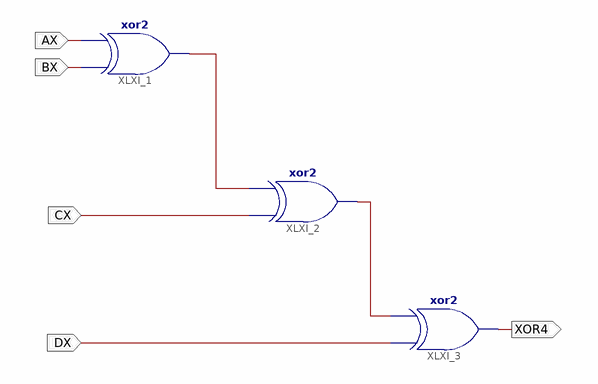
[diagram p0: schematic sheet 1]
// Xilinx ISE schematic XOR_4.sch (spartan6) as structural Verilog: 3 symbols, 5 ports
module XOR_4 (
  input  CX,
  input  DX,
  input  AX,
  input  BX,
  output XOR4
);

  wire XLXN_1, XLXN_2;

  xor XLXI_1 (XLXN_1, BX, AX);
  xor XLXI_2 (XLXN_2, CX, XLXN_1);
  xor XLXI_3 (XOR4, DX, XLXN_2);
endmodule
